# Altium schematic sheet GaN_PLL.SchDoc
size A4
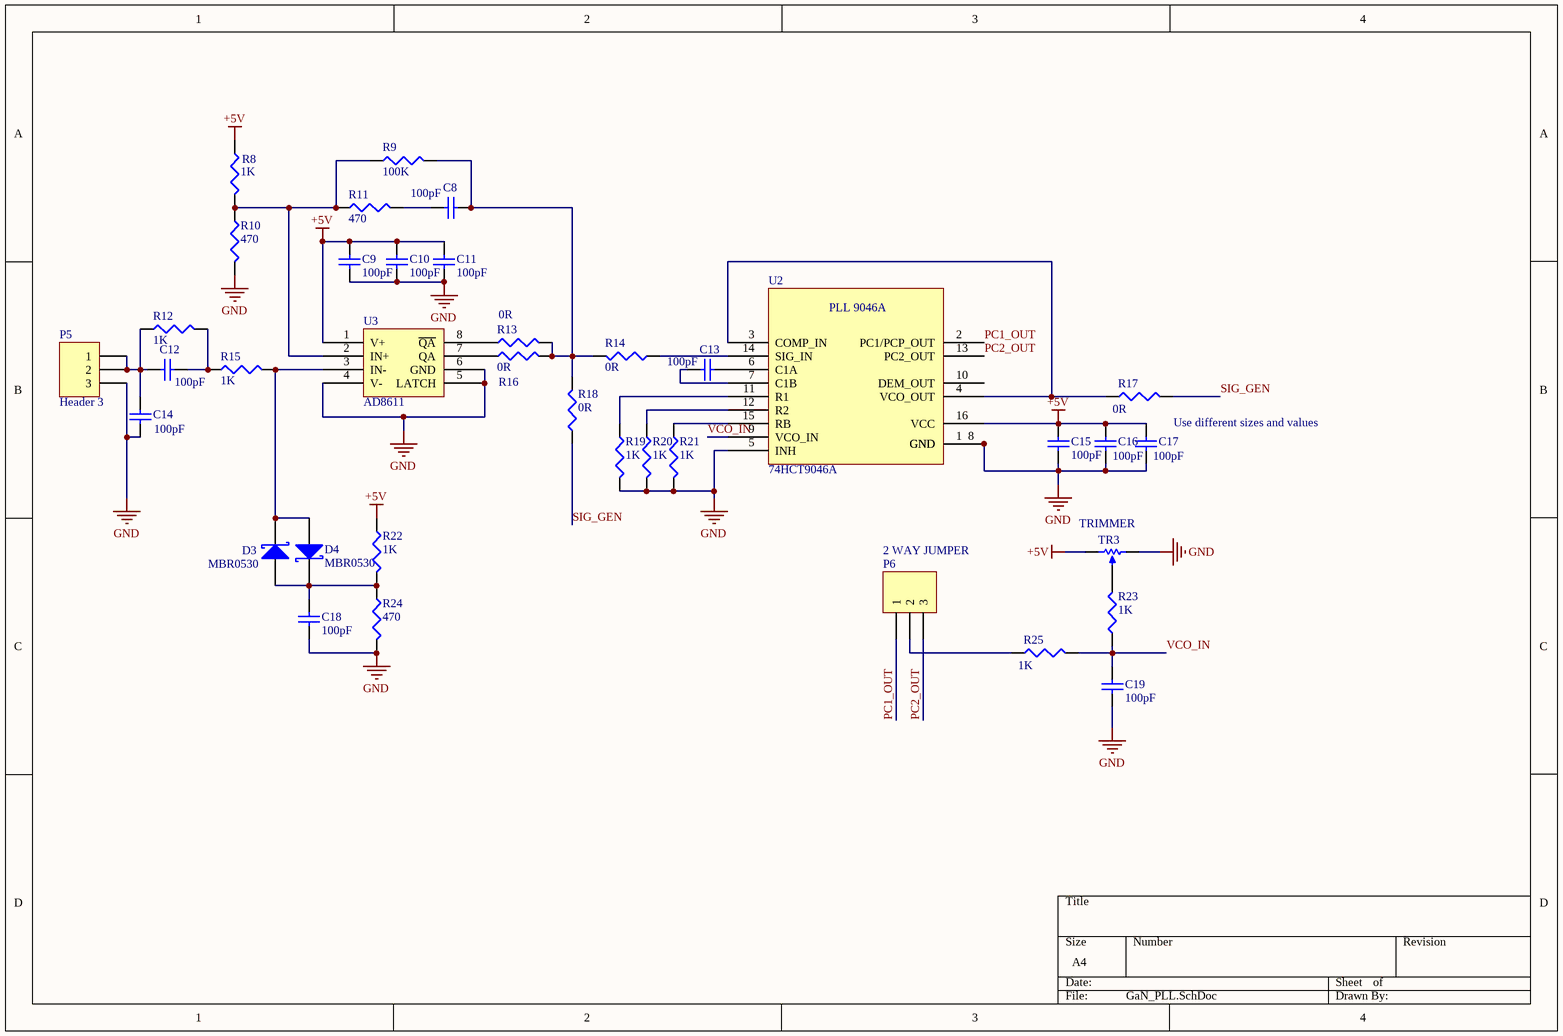
[diagram p0: GaN_PLL.SchDoc]

## Parts
C8  value 100pF  [0603 IPC Low Density]  (hidden comment: Cap Semi)
C9  value 100pF  [0603 IPC Low Density]  (hidden comment: Cap Semi)
C10  value 100pF  [0603 IPC Low Density]  (hidden comment: Cap Semi)
C11  value 100pF  [0603 IPC Low Density]  (hidden comment: Cap Semi)
C12  value 100pF  [0603 IPC Low Density]  (hidden comment: Cap Semi)
C13  value 100pF  [0603 IPC Low Density]  (hidden comment: Cap Semi)
C14  value 100pF  [0805 IPC Low Density]  (hidden comment: Cap Semi)
C15  value 100pF  [0603 IPC Low Density]  (hidden comment: Cap Semi)
C16  value 100pF  [0603 IPC Low Density]  (hidden comment: Cap Semi)
C17  value 100pF  [0603 IPC Low Density]  (hidden comment: Cap Semi)
C18  value 100pF  [0805 IPC Low Density]  (hidden comment: Cap Semi)
C19  value 100pF  [0603 IPC Low Density]  (hidden comment: Cap Semi)
D3  MBR0530  [SOD-123]
D4  MBR0530  [SOD-123]
P5  Header 3  [HDR1X3]
P6  2 WAY JUMPER  [2 WAY JUMPER]
R8  value 1K  [RESISTOR 0603]  (hidden comment: Res3)
R9  value 100K  [RESISTOR 0603]  (hidden comment: Res3)
R10  value 470  [RESISTOR 0603]  (hidden comment: Res3)
R11  value 470  [RESISTOR 0603]  (hidden comment: Res3)
R12  value 1K  [RESISTOR 0603]  (hidden comment: Res3)
R13  value 0R  [RESISTOR 0603]  (hidden comment: Res3)
R14  value 0R  [RESISTOR 0603]  (hidden comment: Res3)
R15  value 1K  [RESISTOR 0603]  (hidden comment: Res3)
R16  value 0R  [RESISTOR 0603]  (hidden comment: Res3)
R17  value 0R  [RESISTOR 0603]  (hidden comment: Res3)
R18  value 0R  [RESISTOR 0603]  (hidden comment: Res3)
R19  value 1K  [RESISTOR 0603]  (hidden comment: Res3)
R20  value 1K  [RESISTOR 0603]  (hidden comment: Res3)
R21  value 1K  [RESISTOR 0603]  (hidden comment: Res3)
R22  value 1K  [RESISTOR 0603]  (hidden comment: Res3)
R23  value 1K  [RESISTOR 0603]  (hidden comment: Res3)
R24  value 470  [RESISTOR 0603]  (hidden comment: Res3)
R25  value 1K  [RESISTOR 0603]  (hidden comment: Res3)
TR3  TRIMMER  [3296W]
U2  74HCT9046A  [SO16]
U3  AD8611  [SOIC8_N]

## Nets
+5V: C9.1 C10.1 C11.1 C15.2 C16.2 C17.2 R8.1 R22.1 TR3.1(TOP) U2.16(VCC) U3.1(V+)
GND: C9.2 C10.2 C11.2 C14.1 C15.1 C16.1 C17.1 C18.1 C19.2 P5.3 R10.2 R19.2 R20.2 R21.2 R24.2 TR3.3(BOT) U2.1(GND) U2.5(INH) U2.8(GND) U3.4(V-) U3.5(LATCH) U3.6(GND)
PC1_OUT: P6.1 U2.2(PC1/PCP_OUT)
PC2_OUT: P6.3 U2.13(PC2_OUT)
SIG_GEN: R17.2 R18.1
VCO_IN: C19.1 R23.1 R25.2 U2.9(VCO_IN)
NetC8_1: C8.1 R9.2 R13.2 R14.2 R16.2 R18.2
NetC8_2: C8.2 R11.2
NetC12_1: C12.1 R12.2 R15.1
NetC12_2: C12.2 C14.2 P5.1 P5.2 R12.1
NetC13_1: C13.1 U2.6(C1A)
NetC13_2: C13.2 U2.7(C1B)
NetC18_2: C18.2 D3.1(A) D4.3(K) R22.2 R24.1
NetD3_3: D3.3(K) D4.1(A) R15.2 U3.3(IN-)
NetP6_2: P6.2 R25.1
NetR8_2: R8.2 R9.1 R10.1 R11.1 U3.2(IN+)
NetR13_1: R13.1 U3.8(~{QA})
NetR14_1: R14.1 U2.14(SIG_IN)
NetR16_1: R16.1 U3.7(QA)
NetR17_1: R17.1 U2.3(COMP_IN) U2.4(VCO_OUT)
NetR19_1: R19.1 U2.11(R1)
NetR20_1: R20.1 U2.12(R2)
NetR21_1: R21.1 U2.15(RB)
NetR23_2: R23.2 TR3.2(TAP)

Not connected (* = marked no-connect by the designer): U2 10(DEM_OUT)

## Notes on the sheet
- Use different sizes and values
- (in symbol 74HCT9046A) PLL 9046A

## Library data of the parts
C8-C19 = Cap Semi: Capacitor (Semiconductor SIM Model); Published: 8-Jun-2000; LatestRevisionDate: 29-May-2009; LatestRevisionNote: IPC-7351 Footprint Added.; PackageReference: C1206; Publisher: Altium Limited; PackageDescription: Chip Capacitor
D3 D4 = MBR0530: Schottky Rectifier, SOD-123
P5 = Header 3: Header, 3-Pin; LatestRevisionDate: 17-Jul-2002; LatestRevisionNote: Re-released for DXP Platform.; Publisher: Altium Limited
P6 = Header 3: LatestRevisionDate: 17-Jul-2002; LatestRevisionNote: Re-released for DXP Platform.; Publisher: Altium Limited
R8-R25 = Res3: Resistor; Published: 8-Jun-2000; LatestRevisionDate: 29-May-2009; LatestRevisionNote: IPC-7351 Footprint Added.; PackageReference: J1-0603; Publisher: Altium Limited; PackageDescription: Chip Resistor
TR3 = TRIMMER 3296W
U2 = 74HCT9046A: Phase Locked Loops - PLL PLL BAND GAP CNTRL W/VCO
U3 = AD8611: Ultrafast, 4 ns Single-Supply Comparators